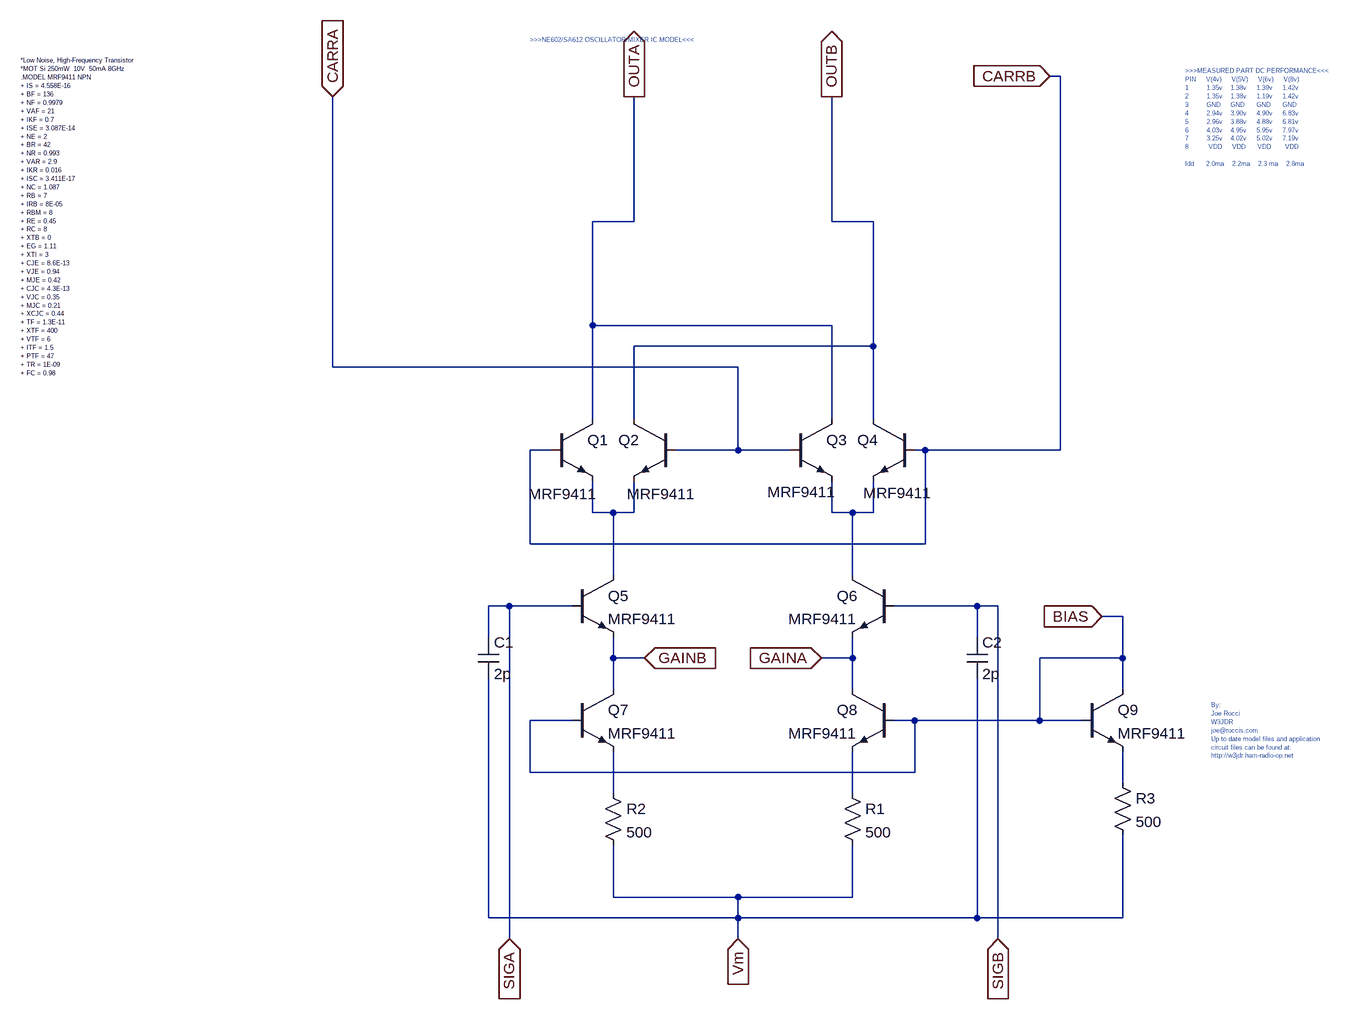
[diagram p0: schematic gilbert.asc]
gilbert.asc, the LTspice schematic file:
Version 4
SHEET 1 2600 1660
WIRE 288 -640 272 -640
WIRE -368 -416 -368 -608
WIRE -368 -416 -432 -416
WIRE -64 -416 -64 -608
WIRE 0 -416 -64 -416
WIRE -432 -256 -432 -416
WIRE -64 -256 -432 -256
WIRE 0 -224 0 -416
WIRE 0 -224 -368 -224
WIRE -832 -192 -832 -608
WIRE -208 -192 -832 -192
WIRE -432 -112 -432 -256
WIRE -368 -112 -368 -224
WIRE -64 -112 -64 -256
WIRE 0 -112 0 -224
WIRE -496 -64 -528 -64
WIRE -208 -64 -208 -192
WIRE -208 -64 -304 -64
WIRE -128 -64 -208 -64
WIRE 80 -64 64 -64
WIRE 288 -64 288 -640
WIRE 288 -64 80 -64
WIRE -432 32 -432 -16
WIRE -400 32 -432 32
WIRE -368 32 -368 -16
WIRE -368 32 -400 32
WIRE -64 32 -64 -16
WIRE -32 32 -64 32
WIRE 0 32 0 -16
WIRE 0 32 -32 32
WIRE -528 80 -528 -64
WIRE 80 80 80 -64
WIRE 80 80 -528 80
WIRE -400 128 -400 32
WIRE -32 128 -32 32
WIRE -560 176 -592 176
WIRE -464 176 -560 176
WIRE 160 176 32 176
WIRE 192 176 160 176
WIRE 384 192 352 192
WIRE -592 224 -592 176
WIRE 160 224 160 176
WIRE -400 256 -400 224
WIRE -352 256 -400 256
WIRE -32 256 -32 224
WIRE -32 256 -80 256
WIRE 384 256 384 192
WIRE 384 256 256 256
WIRE -400 304 -400 256
WIRE -32 304 -32 256
WIRE 384 304 384 256
WIRE -464 352 -528 352
WIRE 64 352 32 352
WIRE 256 352 256 256
WIRE 256 352 64 352
WIRE 320 352 256 352
WIRE -528 432 -528 352
WIRE 64 432 64 352
WIRE 64 432 -528 432
WIRE 384 448 384 400
WIRE -400 464 -400 400
WIRE -32 464 -32 400
WIRE -400 624 -400 544
WIRE -208 624 -400 624
WIRE -32 624 -32 544
WIRE -32 624 -208 624
WIRE -592 656 -592 288
WIRE -208 656 -208 624
WIRE -208 656 -592 656
WIRE 160 656 160 288
WIRE 160 656 -208 656
WIRE 384 656 384 528
WIRE 384 656 160 656
WIRE -560 688 -560 176
WIRE -208 688 -208 656
WIRE 192 688 192 176
FLAG -64 -608 OUTB
IOPIN -64 -608 Out
FLAG -368 -608 OUTA
IOPIN -368 -608 Out
FLAG -832 -608 CARRA
IOPIN -832 -608 In
FLAG 272 -640 CARRB
IOPIN 272 -640 In
FLAG 192 688 SIGB
IOPIN 192 688 In
FLAG -560 688 SIGA
IOPIN -560 688 In
FLAG -208 688 Vm
IOPIN -208 688 In
FLAG 352 192 BIAS
IOPIN 352 192 In
FLAG -80 256 GAINA
IOPIN -80 256 In
FLAG -352 256 GAINB
IOPIN -352 256 In
SYMBOL npn -464 128 R0
SYMATTR InstName Q5
SYMATTR Value MRF9411
SYMBOL npn -496 -112 R0
WINDOW 3 117 115 Left 2
SYMATTR Value MRF9411
SYMATTR InstName Q1
SYMBOL npn -128 -112 R0
WINDOW 3 113 114 Left 2
SYMATTR Value MRF9411
SYMATTR InstName Q3
SYMBOL npn -304 -112 M0
WINDOW 3 120 115 Left 2
SYMATTR Value MRF9411
SYMATTR InstName Q2
SYMBOL npn 64 -112 M0
WINDOW 3 120 112 Left 2
SYMATTR Value MRF9411
SYMATTR InstName Q4
SYMBOL npn 32 128 M0
SYMATTR InstName Q6
SYMATTR Value MRF9411
SYMBOL cap -608 224 R0
SYMATTR InstName C1
SYMATTR Value 2p
SYMBOL cap 144 224 R0
SYMATTR InstName C2
SYMATTR Value 2p
SYMBOL npn -464 304 R0
SYMATTR InstName Q7
SYMATTR Value MRF9411
SYMBOL npn 32 304 M0
SYMATTR InstName Q8
SYMATTR Value MRF9411
SYMBOL res -48 448 R0
SYMATTR InstName R1
SYMATTR Value 500
SYMBOL res -416 448 R0
SYMATTR InstName R2
SYMATTR Value 500
SYMBOL npn 320 304 R0
SYMATTR InstName Q9
SYMATTR Value MRF9411
SYMBOL res 368 432 R0
SYMATTR InstName R3
SYMATTR Value 500
TEXT -1312 -664 Left 0 !*Low Noise, High-Frequency Transistor\n*MOT Si 250mW  10V  50mA 8GHz \n.MODEL MRF9411 NPN \n+ IS = 4.558E-16 \n+ BF = 136 \n+ NF = 0.9979 \n+ VAF = 21 \n+ IKF = 0.7 \n+ ISE = 3.087E-14 \n+ NE = 2 \n+ BR = 42 \n+ NR = 0.993 \n+ VAR = 2.9 \n+ IKR = 0.016 \n+ ISC = 3.411E-17 \n+ NC = 1.087 \n+ RB = 7 \n+ IRB = 8E-05 \n+ RBM = 8 \n+ RE = 0.45 \n+ RC = 8 \n+ XTB = 0 \n+ EG = 1.11 \n+ XTI = 3 \n+ CJE = 8.6E-13 \n+ VJE = 0.94 \n+ MJE = 0.42 \n+ CJC = 4.3E-13 \n+ VJC = 0.35 \n+ MJC = 0.21 \n+ XCJC = 0.44 \n+ TF = 1.3E-11 \n+ XTF = 400 \n+ VTF = 6 \n+ ITF = 1.5 \n+ PTF = 47 \n+ TR = 1E-09 \n+ FC = 0.98
TEXT 480 -648 Left 0 ;>>>MEASURED PART DC PERFORMANCE<<<\nPIN     V(4v)     V(5V)     V(6v)     V(8v)\n1         1.35v    1.38v     1.39v     1.42v\n2         1.35v    1.38v     1.19v     1.42v\n3         GND     GND      GND      GND\n4         2.94v    3.90v     4.90v     6.83v \n5         2.96v    3.88v     4.88v     6.81v\n6         4.03v    4.95v     5.95v     7.97v\n7         3.25v    4.02v     5.02v     7.19v\n8          VDD     VDD      VDD       VDD\n \nIdd      2.0ma    2.2ma    2.3 ma    2.8ma
TEXT 520 328 Left 0 ;By:\nJoe Rocci\nW3JDR\njoe@roccis.com\nUp to date model files and application\ncircuit files can be found at:\nhttp://w3jdr.ham-radio-op.net
TEXT -528 -696 Left 0 ;>>>NE602/SA612 OSCILLATOR/MIXER IC MODEL<<<

The netlist it stands for:
* gilbert.asc
Q5 N001 SIGA GAINB 0 MRF9411
Q1 OUTA CARRB N001 0 MRF9411
Q3 OUTA CARRA N002 0 MRF9411
Q2 OUTB CARRA N001 0 MRF9411
Q4 OUTB CARRB N002 0 MRF9411
Q6 N002 SIGB GAINA 0 MRF9411
C1 SIGA Vm 2p
C2 SIGB Vm 2p
Q7 GAINB BIAS N004 0 MRF9411
Q8 GAINA BIAS N005 0 MRF9411
R1 N005 Vm 500
R2 N004 Vm 500
Q9 BIAS BIAS N003 0 MRF9411
R3 N003 Vm 500
.model NPN NPN
.model PNP PNP
.lib standard.bjt
*Low Noise, High-Frequency Transistor
*MOT Si 250mW  10V  50mA 8GHz
.MODEL MRF9411 NPN
+ IS = 4.558E-16
+ BF = 136
+ NF = 0.9979
+ VAF = 21
+ IKF = 0.7
+ ISE = 3.087E-14
+ NE = 2
+ BR = 42
+ NR = 0.993
+ VAR = 2.9
+ IKR = 0.016
+ ISC = 3.411E-17
+ NC = 1.087
+ RB = 7
+ IRB = 8E-05
+ RBM = 8
+ RE = 0.45
+ RC = 8
+ XTB = 0
+ EG = 1.11
+ XTI = 3
+ CJE = 8.6E-13
+ VJE = 0.94
+ MJE = 0.42
+ CJC = 4.3E-13
+ VJC = 0.35
+ MJC = 0.21
+ XCJC = 0.44
+ TF = 1.3E-11
+ XTF = 400
+ VTF = 6
+ ITF = 1.5
+ PTF = 47
+ TR = 1E-09
+ FC = 0.98
* >>>MEASURED PART DC PERFORMANCE<<<
* PIN     V(4v)     V(5V)     V(6v)     V(8v)
* 1         1.35v    1.38v     1.39v     1.42v
* 2         1.35v    1.38v     1.19v     1.42v
* 3         GND     GND      GND      GND
* 4         2.94v    3.90v     4.90v     6.83v
* 5         2.96v    3.88v     4.88v     6.81v
* 6         4.03v    4.95v     5.95v     7.97v
* 7         3.25v    4.02v     5.02v     7.19v
* 8          VDD     VDD      VDD       VDD
* Idd      2.0ma    2.2ma    2.3 ma    2.8ma
* By:
* Joe Rocci
* W3JDR
* joe@roccis.com
* Up to date model files and application
* circuit files can be found at:
* http://w3jdr.ham-radio-op.net
* >>>NE602/SA612 OSCILLATOR/MIXER IC MODEL<<<
.backanno
.end